# Altium schematic sheet Sheet1.SchDoc
size A; SheetNumber: 1; SheetTotal: 1
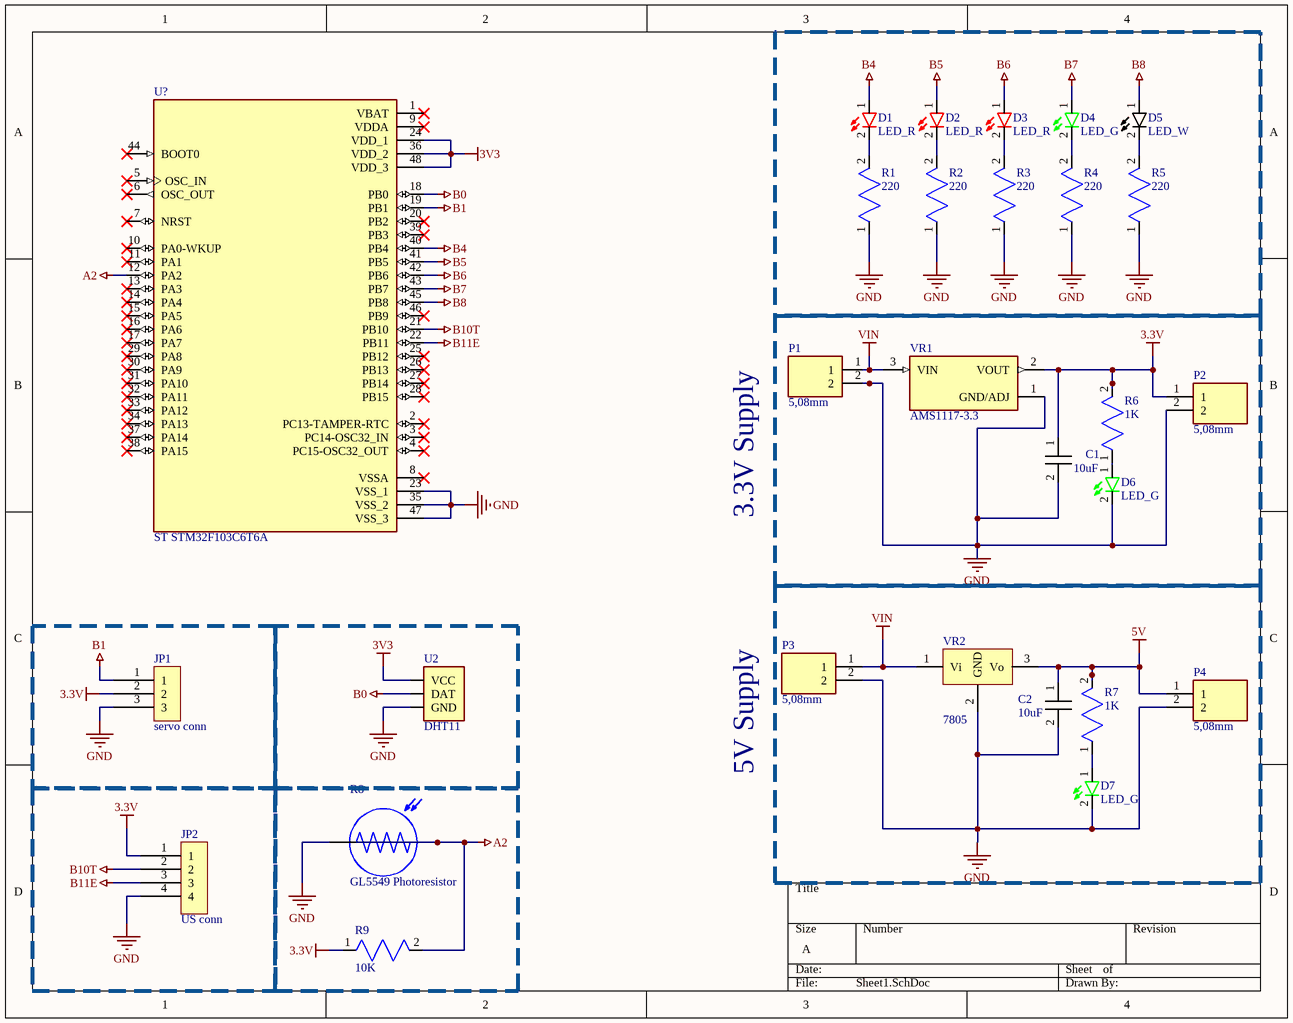
[diagram p0: Sheet1.SchDoc]

## Parts
C1  10uF  [Cap_0805]
C2  10uF  [Cap_0805]
D1  LED_R  [LED_0805]
D2  LED_R  [LED_0805]
D3  LED_R  [LED_0805]
D4  LED_G  [LED_0805]
D5  LED_W  [LED_0805]
D6  LED_G  [LED_0805]
D7  LED_G  [LED_0805]
JP1  servo conn  [HDR 1~3 2.54mm]
JP2  US conn  [HDR Male1~4 2.54mm]
P1  5,08mm  [Screw_terminal_block_5.0]
P2  5,08mm  [Screw_terminal_block_5.0]
P3  5,08mm  [Screw_terminal_block_5.0]
P4  5,08mm  [Screw_terminal_block_5.0]
R1  220  [Res_0805]
R2  220  [Res_0805]
R3  220  [Res_0805]
R4  220  [Res_0805]
R5  220  [Res_0805]
R6  1K  [Res_0805]
R7  1K  [Res_0805]
R8  GL5549 Photoresistor  [GL5549 Photoresistor]
R9  10K  [Res_0805]
U2  DHT11  [DHT11]
U?  ST STM32F103C6T6A  [STM32F103C6T6A]
VR1  AMS1117-3.3  [AMS1117-3.3]
VR2  7805  [TO-220-3]

## Nets
3.3V: C1.1 JP1.2 JP2.1 P2.1 R6.2 R9.1 VR1.2(VOUT)
3V3: U2.1(VCC) U?.24(VDD_1) U?.36(VDD_2) U?.48(VDD_3)
5V: C2.1 P4.1 R7.2 VR2.3(Vo)
A2: R8.2 R9.2 U?.12(PA2)
B0: U2.2(DAT) U?.18(PB0)
B1: JP1.1 U?.19(PB1)
B4: D1.1 U?.40(PB4)
B5: D2.1 U?.41(PB5)
B6: D3.1 U?.42(PB6)
B7: D4.1 U?.43(PB7)
B8: D5.1 U?.45(PB8)
B10T: JP2.2 U?.21(PB10)
B11E: JP2.3 U?.22(PB11)
GND: C1.2 C2.2 D6.2 D7.2 JP1.3 JP2.4 P1.2 P2.2 P3.2 P4.2 R1.1 R2.1 R3.1 R4.1 R5.1 R8.1 U2.4(GND) U?.23(VSS_1) U?.35(VSS_2) U?.47(VSS_3) VR1.1(GND/ADJ) VR2.2(GND)
VIN: P1.1 P3.1 VR1.3(VIN) VR2.1(Vi)
NetD1_2: D1.2 R1.2
NetD2_2: D2.2 R2.2
NetD3_2: D3.2 R3.2
NetD4_2: D4.2 R4.2
NetD5_2: D5.2 R5.2
NetD6_1: D6.1 R6.1
NetD7_1: D7.1 R7.1

Not connected (* = marked no-connect by the designer): U? 1(VBAT)* 2(PC13-TAMPER-RTC)* 3(PC14-OSC32_IN)* 4(PC15-OSC32_OUT)* 5(OSC_IN)* 6(OSC_OUT)* 7(NRST)* 8(VSSA)* 9(VDDA)* 10(PA0-WKUP)* 11(PA1)* 13(PA3)* 14(PA4)* 15(PA5)* 16(PA6)* 17(PA7)* 20(PB2)* 25(PB12)* 26(PB13)* 27(PB14)* 28(PB15)* 29(PA8)* 30(PA9)* 31(PA10)* 32(PA11)* 33(PA12)* 34(PA13)* 37(PA14)* 38(PA15)* 39(PB3)* 44(BOOT0)* 46(PB9)*

## Notes on the sheet
- 3.3V Supply
- 5V Supply

## Library data of the parts
C1 C2 = cap_0805_10uF: 25V 10uF X5R ±10% 0805 Multilayer Ceramic Capacitors MLCC - SMD/SMT ROHS; Manufacturer: Samsung Electro-Mechanics CL21A226MAYNNNE; Mfr. Part #: CL21A106KAYNNNE; Splr.part#: C15850; Supplier: LCSC; ComponentLink1Description: New link; ComponentLink1URL: https://www.lcsc.com/product-detail/C15850.html?s_z=n_cap%25200805%252010uF
D1-D3 = LED_R: RED 568nm LED Indication - Discrete 2.2V Radial; Manufacturer: Amicc; Mfr.Part#: A-SP192DGHC-C01-4T; Splr.Part#: C19171301; Supplier: LCSC
D4 D6 D7 = LED_G: Green 568nm LED Indication - Discrete 2.2V Radial; Manufacturer: Amicc; Mfr.Part#: A-SP192DGHC-C01-4T; Splr.Part#: C19171301; Supplier: LCSC
D5 = LED_W: WHITE 568nm LED Indication - Discrete 2.2V Radial; Manufacturer: Amicc; Mfr.Part#: A-SP192DGHC-C01-4T; Splr.Part#: C19171301; Supplier: LCSC
JP1 = 1 x 3 MALE PINHEADERS: Gold 3A Through Hole Pin Header 2.5mm 3P 6mm -40℃~+105℃ 3mm 2.54mm Brass Black 1 1x3P Through Hole,P=2.54mm Pin Headers ROHS; Manufacturer: JXTCONN; Mfr.Part#: PZ2.54-1X3P-H25; Splr.Part#: C42431683; Supplier: LCSC
JP2 = 1 x 4 MALE PIN HEADERS: Gold 3A Through Hole Pin Header 2.5mm 6mm 4P -40℃~+105℃ 3mm 2.54mm Black Brass 1 1x4P Through Hole,P=2.54mm Pin Headers ROHS; Manufacturer: hanxia; Mfr.Part#: HX PZ2.54-1x4P ZZ; Splr.Part#: C32713270; Supplier: LCSC
P1-P4 = screw terminal block 2 port: 1x2P 18A -40℃~+105℃ 250V Green 14~30 Through Hole 5.08mm 2.5 1 2 Through Hole,P=5.08mm Screw Terminal Blocks ROHS; Manufacturer: KANGNEX; Mfr. Part #: WJ500V-5.08-2P; Splr.part#: C8465; Supplier: LCSC; ComponentLink1Description: New link; ComponentLink1URL: https://www.lcsc.com/product-detail/C8465.html
R1-R7 R9 = Resistor_0805_1K: 125mW Thick Film Resistor 150V ±100ppm/℃ ±1% 1kΩ 0805 Chip Resistor - Surface Mount ROHS; Manufacturer: YAGEO; Mfr. Part #: RC0805FR-071KL; Splr.part#: C95781; Supplier: LCSC; ComponentLink1Description: New link; ComponentLink1URL: https://www.lcsc.com/product-detail/C95781.html?s_z=n_resistor%25200805%25201k
R8 = GL5549 Photoresistor: 540nm 100kΩ~200kΩ 10MΩ Through Hole,P=3mm Photoresistors ROHS; Manufacturer: Senba Sensing Tech; Mfr. Part #: GL5549; supplier: *LCSC; supplier Part #: C125631; ComponentLink1Description: Datasheet; ComponentLink1URL: https://www.lcsc.com/datasheet/C125631.pdf
U2 = DHT11: ±5%RH -20℃~+60℃ 5%RH~95%RH SIP-4 Temperature and Humidity Sensor ROHS; Manufacturer: Aosong; Mfr. Part #: DHT11; supplier: *LCSC; supplier Part #: C117051; ComponentLink1Description: Datasheet; ComponentLink1URL: https://www.lcsc.com/datasheet/C117051.pdf
U? = ST STM32F103C6T6A: ARM-M3 72MHz LQFP-48(7x7) Microcontrollers (MCU/MPU/SOC) ROHS; Manufacturer: ST; Mfr. Part #: STM32F103C6T6A; supplier: *LCSC; supplier Part #: C8303; ComponentLink1Description: Datasheet; ComponentLink1URL: https://www.lcsc.com/datasheet/C125631.pdf
VR1 = AMS1117-3.3: 72dB@(120Hz) 1A Fixed 3.3V Positive 16V SOT-223 Voltage Regulators - Linear, Low Drop Out (LDO) Regulators ROHS; Manufacturer: Advanced Monolithic Systems; Splr.Part#: C6186; Supplieer: LCSC; Mfr. Part #: AMS1117-3.3; ComponentLink1Description: New link; ComponentLink1URL: https://www.lcsc.com/product-detail/C3795.html?s_z=n_7805
VR2 = 7805: 62dB@(120Hz) 1.5A Fixed 5V Positive 25V TO-220 Voltage Regulators - Linear, Low Drop Out (LDO) Regulators ROHS; Manufacturer: ST; Mfr. Part #: L7805CV-DG; Splr.Part#: C3795; Supplieer: LCSC; ComponentLink1Description: New link; ComponentLink1URL: https://www.lcsc.com/product-detail/C3795.html?s_z=n_7805